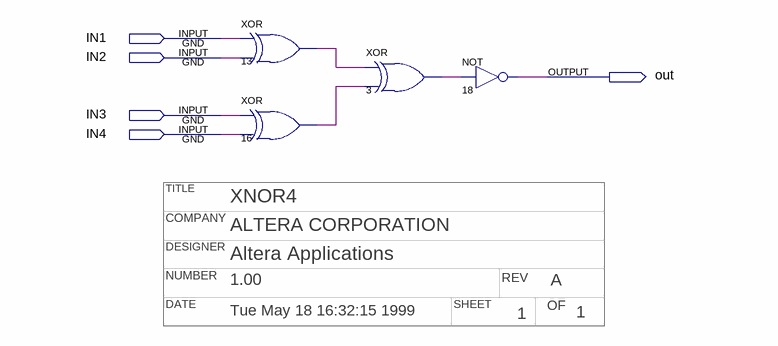
[diagram p0: schematic sheet]
// Quartus schematic xnor4.bdf as structural Verilog: 4 symbols, 5 pins
// Title block: TITLE: XNOR4; COMPANY: ALTERA CORPORATION; DESIGNER: Altera Applications; NUMBER: 1.00; REV: A; DATE: Tue May 18 16:32:15 1999; SHEET: 1; OF: 1
module xnor4 (
  input  IN1,
  input  IN2,
  input  IN3,
  input  IN4,
  output out
);

  wire n3_out, n13_out, n16_out;

  xor u_13 (n13_out, IN1, IN2);
  xor u_16 (n16_out, IN3, IN4);
  xor u_3 (n3_out, n13_out, n16_out);
  not u_18 (out, n3_out);
endmodule
